# Altium schematic sheet 驱动原理图.SchDoc
size A3
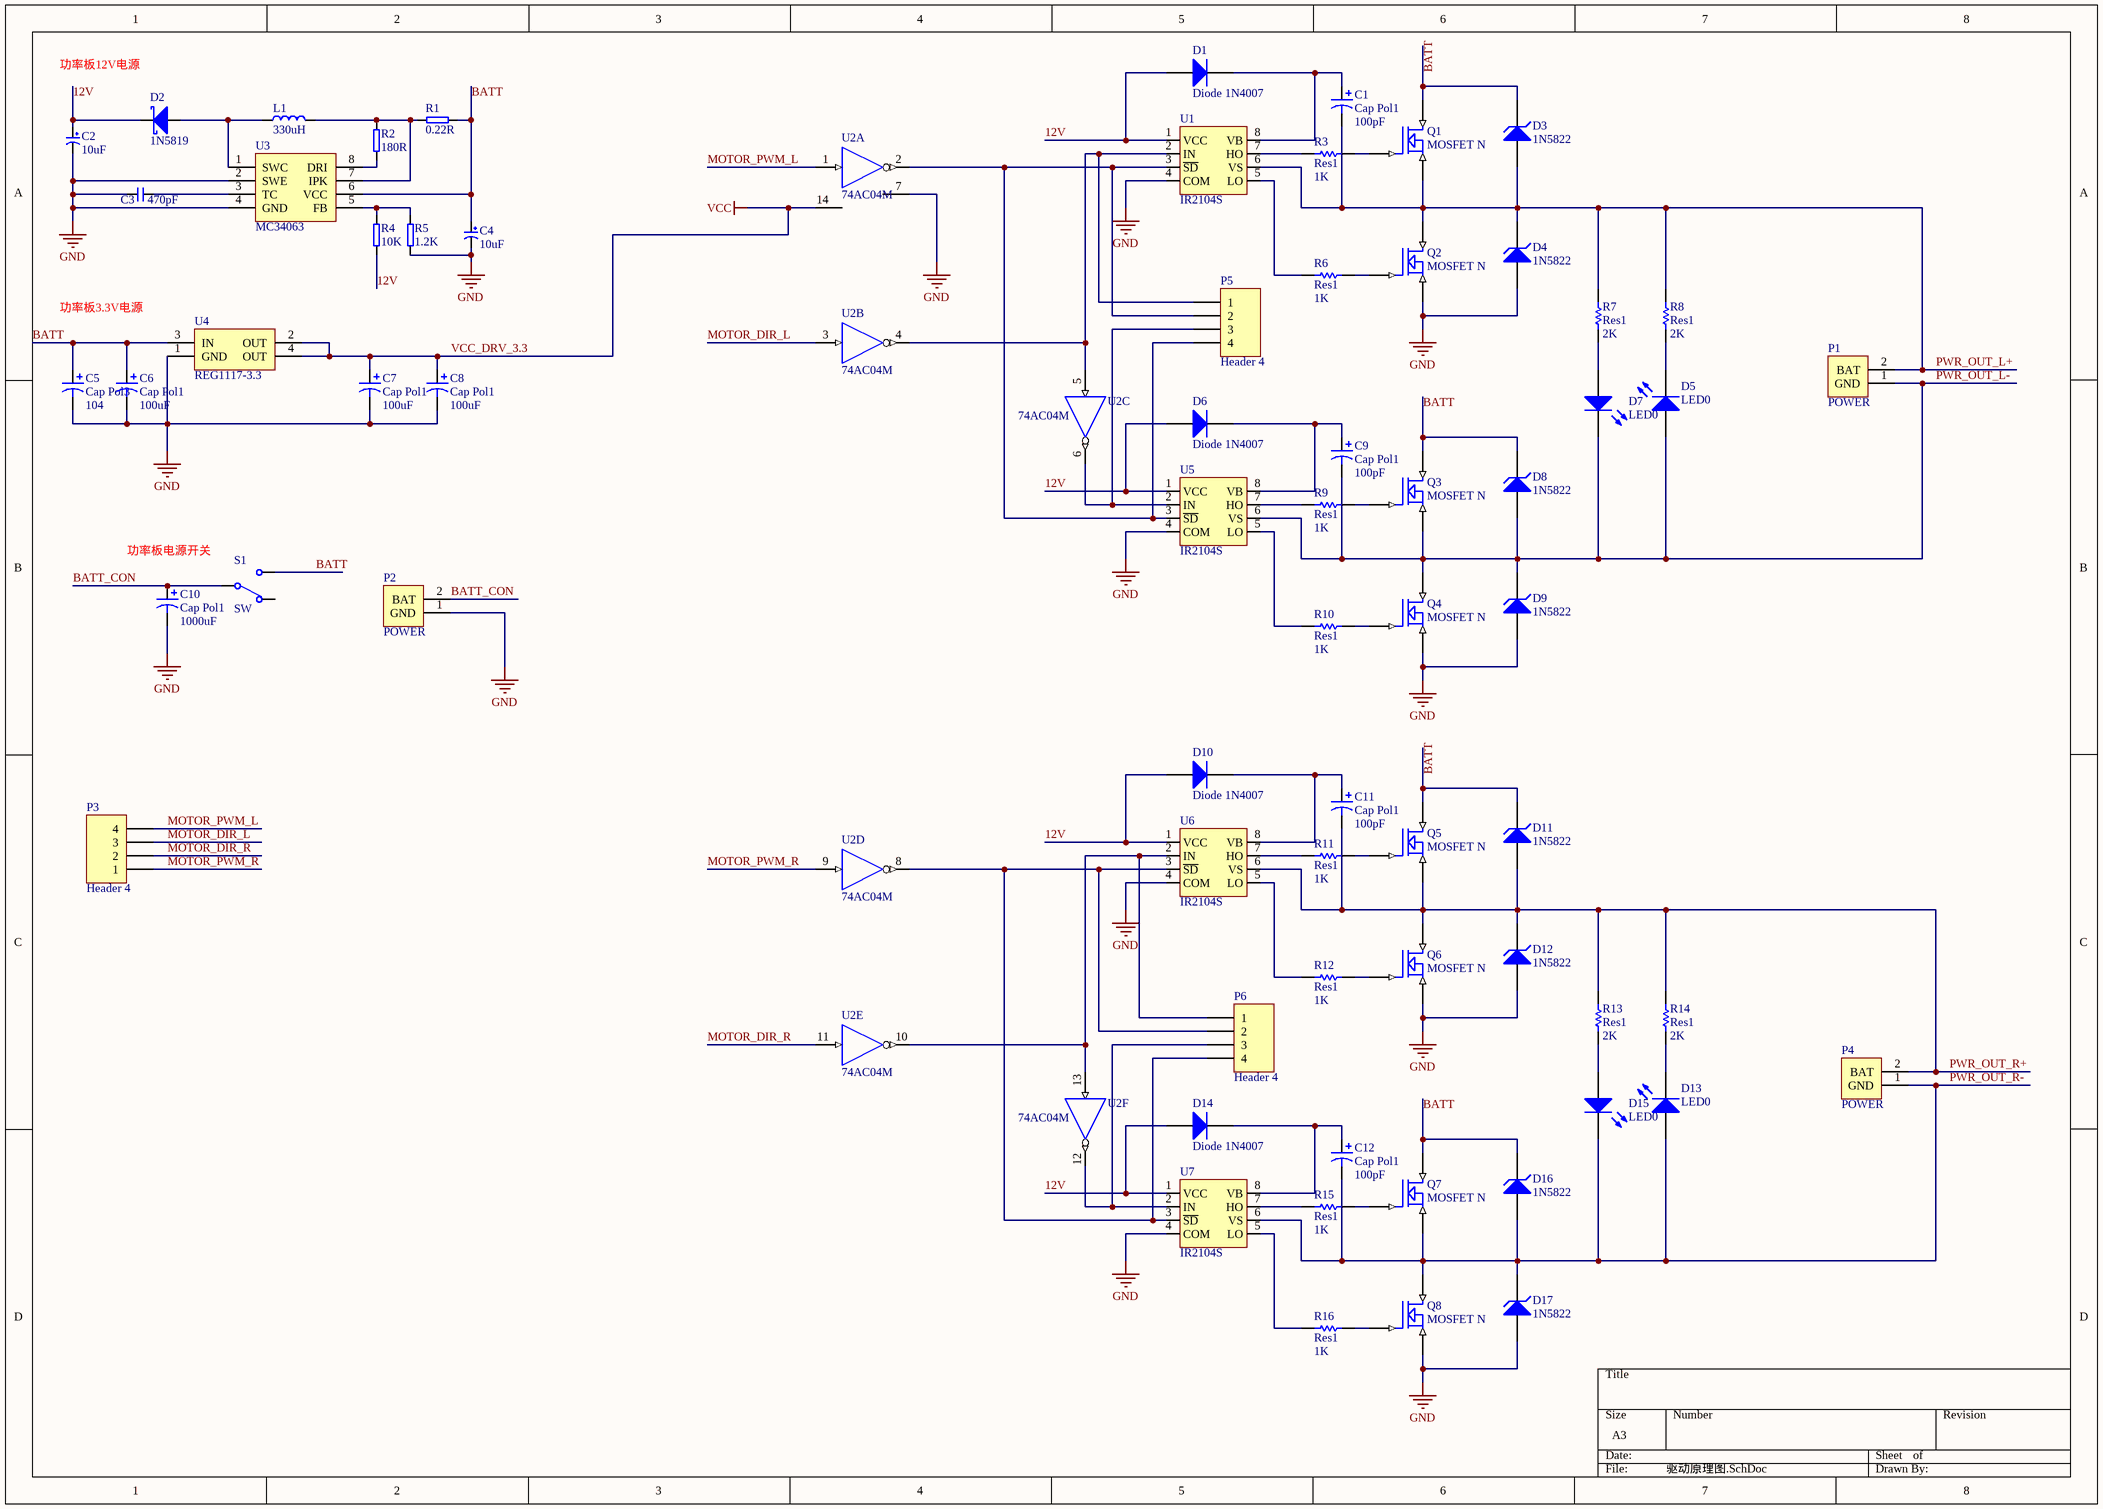
[diagram p0: 驱动原理图.SchDoc]

## Parts
C1  Cap Pol1  value 100pF  [C0805]
C2  10uF  [3216-CAP-TA]
C3  470pF  [0603-CAP]
C4  10uF  [3216-CAP-TA]
C5  Cap Pol3  value 104  [0805]
C6  Cap Pol1  value 100uF  [RB.1/.2 - duplicate]
C7  Cap Pol1  value 100uF  [RB.1/.2 - duplicate]
C8  Cap Pol1  value 100uF  [RB.1/.2 - duplicate]
C9  Cap Pol1  value 100pF  [C0805]
C10  Cap Pol1  value 1000uF  [CAPP]
C11  Cap Pol1  value 100pF  [C0805]
C12  Cap Pol1  value 100pF  [C0805]
D1  Diode 1N4007  [DO-214AC(SMA)-SBD]
D2  1N5819  [DO-214AC(SMA)-SBD]
D3  1N5822  [DO-214AC(SMA)-SBD]
D4  1N5822  [DO-214AC(SMA)-SBD]
D5  LED0  [3.5X2.8X1.9]
D6  Diode 1N4007  [DO-214AC(SMA)-SBD]
D7  LED0  [3.5X2.8X1.9]
D8  1N5822  [DO-214AC(SMA)-SBD]
D9  1N5822  [DO-214AC(SMA)-SBD]
D10  Diode 1N4007  [DO-214AC(SMA)-SBD]
D11  1N5822  [DO-214AC(SMA)-SBD]
D12  1N5822  [DO-214AC(SMA)-SBD]
D13  LED0  [3.5X2.8X1.9]
D14  Diode 1N4007  [DO-214AC(SMA)-SBD]
D15  LED0  [3.5X2.8X1.9]
D16  1N5822  [DO-214AC(SMA)-SBD]
D17  1N5822  [DO-214AC(SMA)-SBD]
L1  330uH  [Inductor_7*7*4]
P1  POWER  [POWER]
P2  POWER  [POWER]
P3  Header 4  [HDR1X4]
P4  POWER  [POWER]
P5  Header 4  [HDR1X4]
P6  Header 4  [HDR1X4]
Q1  MOSFET N  [TO-252]
Q2  MOSFET N  [TO-252]
Q3  MOSFET N  [TO-252]
Q4  MOSFET N  [TO-252]
Q5  MOSFET N  [TO-252]
Q6  MOSFET N  [TO-252]
Q7  MOSFET N  [TO-252]
Q8  MOSFET N  [TO-252]
R1  0.22R  [0603-RES]
R2  180R  [0603-RES]
R3  Res1  value 1K  [0603-RES]
R4  10K  [0603-RES]
R5  1.2K  [0603-RES]
R6  Res1  value 1K  [0603-RES]
R7  Res1  value 2K  [0603-RES]
R8  Res1  value 2K  [0603-RES]
R9  Res1  value 1K  [0603-RES]
R10  Res1  value 1K  [0603-RES]
R11  Res1  value 1K  [0603-RES]
R12  Res1  value 1K  [0603-RES]
R13  Res1  value 2K  [0603-RES]
R14  Res1  value 2K  [0603-CAP]
R15  Res1  value 1K  [0603-RES]
R16  Res1  value 1K  [0603-RES]
S1  SW  [SW]
U1  IR2104S  [SOIC-8]
U2  74AC04M  [SO14_L]  (parts A,B,C,D,E,F of 6)
U3  MC34063  [SOP-8]
U4  REG1117-3.3  [ZZ311]
U5  IR2104S  [SOIC-8]
U6  IR2104S  [SOIC-8]
U7  IR2104S  [SOIC-8]

## Nets
GND: C2.2 C3.1 C4.2 C5.2 C6.2 C7.2 C8.2 C10.2 D4.1(A) D9.1(A) D12.1(A) D17.1(A) P2.1(GND) Q2.3(S) Q4.3(S) Q6.3(S) Q8.3(S) R5.1 U1.4(COM) U2.7(GND) U3.2(SWE) U3.4(GND) U4.1(GND) U5.4(COM) U6.4(COM) U7.4(COM)
VCC_DRV_3.3: C7.1 C8.1 U2.14(VCC) U4.2(OUT) U4.4(OUT)  [also labelled VCC]
12V: C2.1 D1.1(A) D2.2(K) D6.1(A) D10.1(A) D14.1(A) R4.1 U1.1(VCC) U5.1(VCC) U6.1(VCC) U7.1(VCC)
BATT: C4.1 C5.1 C6.1 D8.2(K) D16.2(K) Q3.2(D) Q7.2(D) R1.2 S1.3 U3.6(VCC) U4.3(IN)
BATT_CON: C10.1 P2.2(BAT) S1.2
MOTOR_DIR_L: P3.3 U2.3(A)
MOTOR_DIR_R: P3.2 U2.11(A)
MOTOR_PWM_L: P3.4 U2.1(A)
MOTOR_PWM_R: P3.1 U2.9(A)
PWR_OUT_L+: C1.2 D3.1(A) D4.2(K) P1.2(BAT) Q1.3(S) Q2.2(D) R7.2 R8.2 U1.6(VS)
PWR_OUT_L-: C9.2 D5.1(A) D7.2(K) D8.1(A) D9.2(K) P1.1(GND) Q3.3(S) Q4.2(D) U5.6(VS)
PWR_OUT_R+: C11.2 D11.1(A) D12.2(K) P4.2(BAT) Q5.3(S) Q6.2(D) R13.2 R14.2 U6.6(VS)
PWR_OUT_R-: C12.2 D13.1(A) D15.2(K) D16.1(A) D17.2(K) P4.1(GND) Q7.3(S) Q8.2(D) U7.6(VS)
NetC1_1: C1.1 D1.2(K) U1.8(VB)
NetC3_2: C3.2 U3.3(TC)
NetC9_1: C9.1 D6.2(K) U5.8(VB)
NetC11_1: C11.1 D10.2(K) U6.8(VB)
NetC12_1: C12.1 D14.2(K) U7.8(VB)
NetD2_1: D2.1(A) L1.1 U3.1(SWC)
NetD3_2: D3.2(K) Q1.2(D)
NetD5_2: D5.2(K) R8.1
NetD7_1: D7.1(A) R7.1
NetD11_2: D11.2(K) Q5.2(D)
NetD13_2: D13.2(K) R14.1
NetD15_1: D15.1(A) R13.1
NetL1_2: L1.2 R1.1 R2.2 U3.7(IPK)
NetP5_1: P5.1 U1.2(IN) U2.4(Y) U2.5(A)
NetP5_2: P5.2 P5.4 U1.3(~{SD}) U2.2(Y) U5.3(~{SD})
NetP5_3: P5.3 U2.6(Y) U5.2(IN)
NetP6_1: P6.1 U2.10(Y) U2.13(A) U6.2(IN)
NetP6_2: P6.2 P6.4 U2.8(Y) U6.3(~{SD}) U7.3(~{SD})
NetP6_3: P6.3 U2.12(Y) U7.2(IN)
NetQ1_1: Q1.1(G) R3.2
NetQ2_1: Q2.1(G) R6.2
NetQ3_1: Q3.1(G) R9.2
NetQ4_1: Q4.1(G) R10.2
NetQ5_1: Q5.1(G) R11.2
NetQ6_1: Q6.1(G) R12.2
NetQ7_1: Q7.1(G) R15.2
NetQ8_1: Q8.1(G) R16.2
NetR2_1: R2.1 U3.8(DRI)
NetR3_1: R3.1 U1.7(HO)
NetR4_2: R4.2 R5.2 U3.5(FB)
NetR6_1: R6.1 U1.5(LO)
NetR9_1: R9.1 U5.7(HO)
NetR10_1: R10.1 U5.5(LO)
NetR11_1: R11.1 U6.7(HO)
NetR12_1: R12.1 U6.5(LO)
NetR15_1: R15.1 U7.7(HO)
NetR16_1: R16.1 U7.5(LO)

Not connected (* = marked no-connect by the designer): S1 1

## Notes on the sheet
- 功率板12V电源
- 功率板3.3V电源
- (near C10) 功率板电源开关
- Labels drawn without touching a wire or pin: BATT

## Library data of the parts
C1 C6-C12 = Cap Pol1: Polarized Capacitor (Radial); Published: 8-Jun-2000; LatestRevisionDate: 17-Jul-2002; LatestRevisionNote: Re-released for DXP Platform.; PackageReference: RB7.6-15; Publisher: Altium Limited; PackageDescription: Polarized Capacitor (Radial); 2 Leads
C2 C4 = CAP_TA_3216
C3 = CAP_0603
C5 = Cap Pol3: Polarized Capacitor (Surface Mount); Published: 8-Jun-2000; LatestRevisionDate: 29-May-2009; LatestRevisionNote: IPC-7351 Footprint Added.; PackageReference: C0805; Publisher: Altium Limited; PackageDescription: Chip Capacitor
D1 D6 D10 D14 = Diode 1N4007: 1 Amp General Purpose Rectifier; Published: 8-Jun-2000; LatestRevisionDate: 17-Jul-2002; LatestRevisionNote: Re-released for DXP Platform.; DatasheetVersion: 1998; PackageVersion: Aug-1999; PackageReference: DO-41; Publisher: Altium Limited; PackageDescription: Diode, Axial; Body 5.2 x 2.7 mm (LxDia. max), Lead Dia. 0.86 mm (max); Code_JEDEC: DO-204-AL; ComponentLink1Description: Manufacturer Link; ComponentLink1URL: http://www.fairchildsemi.com/; ComponentLink2Description: Datasheet; ComponentLink2URL: http://www.fairchildsemi.com/ds/1N%2F1N4001.pdf
D3 D4 D8 D9 D11 D12 D16 D17 = 1N4760A: One Watt Hermetically Sealed Glass Silicon Zener Diode; Published: 29-Sep-2000; LatestRevisionDate: 17-Jul-2002; LatestRevisionNote: Re-released for DXP Platform.; PackageReference: 59-03; Publisher: Altium Limited; PackageDescription: Diode, Axial; Body 5.2 x 2.7 mm (LxDia. max), Lead Dia. 0.86 mm (max); Code_JEDEC: DO-204-AL; ComponentLink1Description: Manufacturer Link; ComponentLink1URL: http://www.onsemi.com/site/products/landing?taxonomyID=194
D5 D7 D13 D15 = LED0: Typical INFRARED GaAs LED; Published: 8-Jun-2000; LatestRevisionDate: 08-Jul-2005; LatestRevisionNote: Mech Layer 1 removed.; PackageReference: LED-0; Publisher: Altium Limited; PackageDescription: LED; 2 Leads
L1 = inductor_7*7*4
P3 P5 P6 = Header 4: Header, 4-Pin; LatestRevisionDate: 17-Jul-2002; LatestRevisionNote: Re-released for DXP Platform.; Publisher: Altium Limited
R1 R2 R4 R5 = RES_0603
R3 R6-R16 = Res1: Resistor; Published: 8-Jun-2000; LatestRevisionDate: 17-Jul-2002; LatestRevisionNote: Re-released for DXP Platform.; PackageReference: AXIAL-0.3; Publisher: Altium Limited; PackageDescription: Axial Device, Thru-Hole; 2 Leads; 0.3 in Pin Spacing
U2 = 74AC04M: Hex Inverter; Published: 8-Jun-2000; LatestRevisionDate: 13-Apr-2006; LatestRevisionNote: IPC-7351 Footprint Added.; DatasheetVersion: Apr-1997; PackageVersion: Sep-1998; PackageReference: SO14; Publisher: Altium Limited; PackageDescription: 14-Pin Small Outline Integrated Circuit 1.27 mm Pitch; Code_IPC: SOIC127P600-14; ComponentLink1Description: Manufacturer Link; ComponentLink1URL: http://www.st.com/; ComponentLink2Description: Datasheet; ComponentLink2URL: http://www.st.com/stonline/products/literature/ds/4936/74ac04.pdf
U4 = REG1117-3.3: 800mA and 1A Low Dropout Positive Regulator 2.85V, 3.3V, 5V, and Adjustable; Published: 8-Jun-2000; LatestRevisionDate: 17-Jul-2002; LatestRevisionNote: Re-released for DXP Platform.; DatasheetVersion: Sep-1997; PackageVersion: revC; PackageReference: ZZ311; Publisher: Altium Limited; PackageDescription: SOT-223/SC-73; 4 Leads; Body 6.7 x 7.3 mm, inc. leads (LxW max); ComponentLink1Description: Manufacturer Link; ComponentLink1URL: http://www.ti.com/; ComponentLink2Description: Datasheet; ComponentLink2URL: http://www-s.ti.com/sc/ds/REG1117.pdf